# Altium schematic sheet BlueToothCar.SchDoc
size A
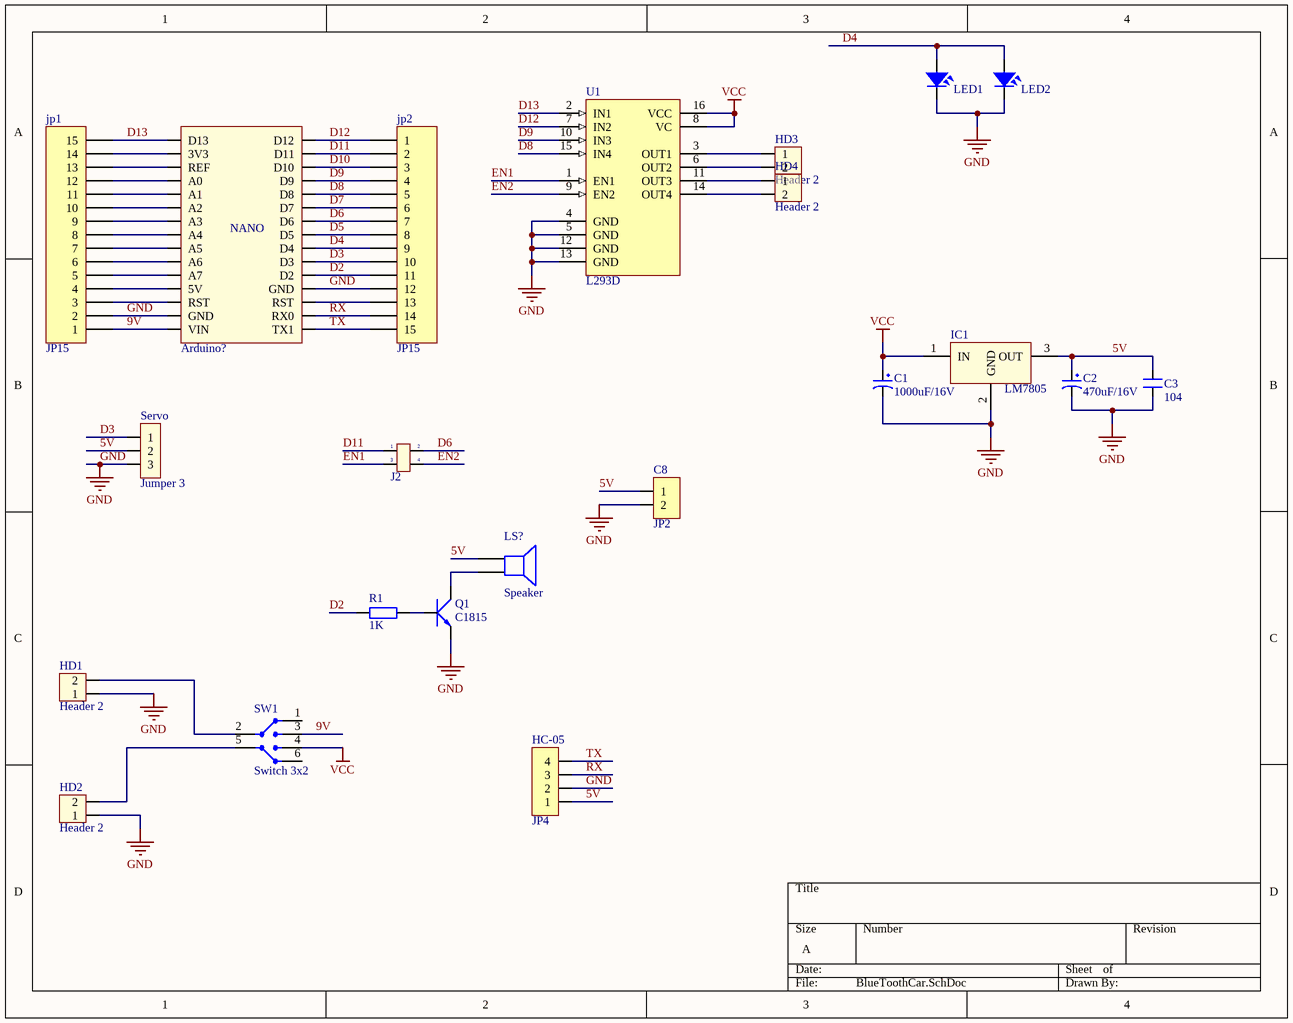
[diagram p0: BlueToothCar.SchDoc]

## Parts
Arduino?  Arduino Nano  [Arduino Nano]  (value not drawn)
C1  1000uF/16V  [CP1.5/3.4]
C2  470uF/16V  [CP1.5/3.4]
C3  104  [SM-0805]
C8  JP2  [JP2-D1T]
HC-05  JP4  [JP4-C1T]
HD1  Header 2  [HED2]
HD2  Header 2  [HED2]
HD3  Header 2  [HED2]
HD4  Header 2  [HED2]
IC1  LM7805  [QTO-220H3]
J2  Jumper 2x2  [JP2X2]  (value not drawn)
jp1  JP15  [JP15-C1T]
jp2  JP15  [JP15-C1T]
LED1  LED  [LED-5-BLUE]  (value not drawn)
LED2  LED  [LED-5-BLUE]  (value not drawn)
LS?  Speaker  [SPEAKER]
Q1  C1815  [SOT23B]
R1  1K  [SM-0805]
Servo  Jumper 3  [JP3]
SW1  Switch 3x2  [SW3-DIP]
U1  L293D  [DIP16]

## Nets
GND: Arduino?.GND C1.2 C2.2 C3.1 C8.2 HC-05.2 HD1.1 HD2.1 IC1.2(GND) jp1.2 jp2.12 LED1.2 LED2.2 Q1.1(E) Servo.3 U1.4(GND) U1.5(GND) U1.12(GND) U1.13(GND)
VCC: C1.1 IC1.1(IN) SW1.4 U1.8(VC) U1.16(VCC)
5V: C2.1 C3.2 C8.1 HC-05.1 IC1.3(OUT) LS?.1 Servo.2
9V: Arduino?.VIN jp1.1 SW1.3(I/O2)
D2: Arduino?.D2 jp2.11 R1.1
D3: Arduino?.D3 jp2.10 Servo.1
D4: Arduino?.D4 jp2.9 LED1.1 LED2.1
D5: Arduino?.D5 jp2.8
D6: Arduino?.D6 J2.2 jp2.7
D7: Arduino?.D7 jp2.6
D8: Arduino?.D8 jp2.5 U1.15(IN4)
D9: Arduino?.D9 jp2.4 U1.10(IN3)
D10: Arduino?.D10 jp2.3
D11: Arduino?.D11 J2.1 jp2.2
D12: Arduino?.D12 jp2.1 U1.7(IN2)
D13: Arduino?.D13 jp1.15 U1.2(IN1)
EN1: J2.3 U1.1(EN1)
EN2: J2.4 U1.9(EN2)
RX: Arduino?.RX0 HC-05.3 jp2.14
TX: Arduino?.TX1 HC-05.4 jp2.15
NetArduino?_3V3: Arduino?.3V3 jp1.14
NetArduino?_5V: Arduino?.5V jp1.4
NetArduino?_A0: Arduino?.A0 jp1.12
NetArduino?_A1: Arduino?.A1 jp1.11
NetArduino?_A2: Arduino?.A2 jp1.10
NetArduino?_A3: Arduino?.A3 jp1.9
NetArduino?_A4: Arduino?.A4 jp1.8
NetArduino?_A5: Arduino?.A5 jp1.7
NetArduino?_A6: Arduino?.A6 jp1.6
NetArduino?_A7: Arduino?.A7 jp1.5
NetArduino?_REF: Arduino?.REF jp1.13
NetArduino?_RST: Arduino?.RST jp1.3
NetArduino?_RST: Arduino?.RST jp2.13  [a separate net that carries the same name]
NetHD1_2: HD1.2 SW1.2
NetHD2_2: HD2.2 SW1.5
NetHD3_1: HD3.1 U1.3(OUT1)
NetHD3_2: HD3.2 U1.6(OUT2)
NetHD4_1: HD4.1 U1.11(OUT3)
NetHD4_2: HD4.2 U1.14(OUT4)
NetLS?_2: LS?.2 Q1.2(C)
NetQ1_3: Q1.3(B) R1.2

Not connected (* = marked no-connect by the designer): SW1 1 6

## Notes on the sheet
- (in symbol Arduino Nano) NANO

## Library data of the parts
Arduino? = Arduino Nano: Value: Cau 1A
C1 = CP4: Cap 1000uF/16V - 220uF/50V; Description 5: 4,7uF>10uF/250V_3,3uF>10uF/400V - 2,2uF>4,7uF/450V; Description 1: 2200uF-3300uF/6,3V - 1000uF-2200uF/10V; Description 2: 1000uF/16V - 470uF => 1000uF/25V - 100uF/100V; Description 3: 330uF>470uF/35V_220uF>470uF/50V_10uF>22uF/250V; Description 4: 220uF => 330uF/63V - 10uF =>33uF/160 - 200V; Value: 1000uF/16V
C2 = CP3: Cap 100uF/35V - 470uF/16V; Value: 100uF/35V/50V; Description 1: 1000uF/6,3V - 470uF/16V - 330uF - 25V; Description 2: 220uF/35V - 100uF/50V - 63V - 4,7uF/200V; Description 3: 22uF => 33uF100V - 3,3uF => 4,7uF/250V; Description 4: 2,2uF =>3,3uF/350 - 2,2uF/400V - 1uF/450V
C3 = CM: Cap SMD; Value: 103
C8 = JP2: WR-PHD 2.54 mm Angled Socket Header; Manufacturer: W¨¹rth Elektronik eiSos GmbH; partNo: 613002143121; ComponentLink1 Description: Manufacturer; ComponentLink2 Description: Datasheet; NoPins: 02; Created Date: 29 March 2013; ComponentLink1URL: http://www.we-online.com; ComponentLink2URL: http://katalog.we-online.de/em/datasheet/6130xx143121.pdf; Created by: Karrer Zheng
HC-05 = JP4: WR-PHD 2.54 mm Angled Socket Header; Manufacturer: W¨¹rth Elektronik eiSos GmbH; partNo: 613004143121; ComponentLink1 Description: Manufacturer; ComponentLink2 Description: Datasheet; NoPins: 04; Created Date: 29 March 2013; ComponentLink1URL: http://www.we-online.com; ComponentLink2URL: http://katalog.we-online.de/em/datasheet/6130xx143121.pdf; Created by: Karrer Zheng
HD1-HD4 = Hed2: Header 2 (Green); Value: Header 2
IC1 = LM78xx: On ap +, from + 5 to + 24VDC; Value: LM7805
J2 = JP2x2: Value: JP 2x2
jp1 jp2 = JP15: WR-PHD 2.54 mm Angled Socket Header; Manufacturer: W¨¹rth Elektronik eiSos GmbH; partNo: 613015143121; ComponentLink1 Description: Manufacturer; ComponentLink2 Description: Datasheet; NoPins: 15; Created Date: 29 March 2013; ComponentLink1URL: http://www.we-online.com; ComponentLink2URL: http://katalog.we-online.de/em/datasheet/6130xx143121.pdf; Created by: Karrer Zheng
LED1 LED2 = LED: LED Single colour Green and Red; Value: LED 3 ly Single Colour
LS? = Speaker: Loudspeaker; Published: 24-Mar-1999; LatestRevisionDate: 17-Jul-2002; LatestRevisionNote: Re-released for DXP Platform.; PackageReference: PIN2; Publisher: Altium Limited
Q1 = C1815: NPN 600mW, ECB; Value: C1815
R1 = RM: Resistor SMD; Value: 1K
Servo = JP3: Value: J3
SW1 = SW3x2: Value: Switch 4x2
U1 = L293D: Push-Pull Four Channel Driver With Diode; Published: 8-Jun-2000; LatestRevisionDate: 06-Jun-2005; LatestRevisionNote: Stylized 3D Model Added.; DatasheetVersion: Jun-1996; PackageVersion: Apr-1996; PackageReference: DIP16; Publisher: Altium Limited; PackageDescription: DIP; 16 Leads; Row Spacing 7.62 mm; Pitch 2.54 mm; ComponentLink1Description: Manufacturer Link; ComponentLink1URL: http://www.st.com/; ComponentLink2Description: Datasheet; ComponentLink2URL: http://www.st.com/stonline/products/literature/ds/1330/l293d.pdf